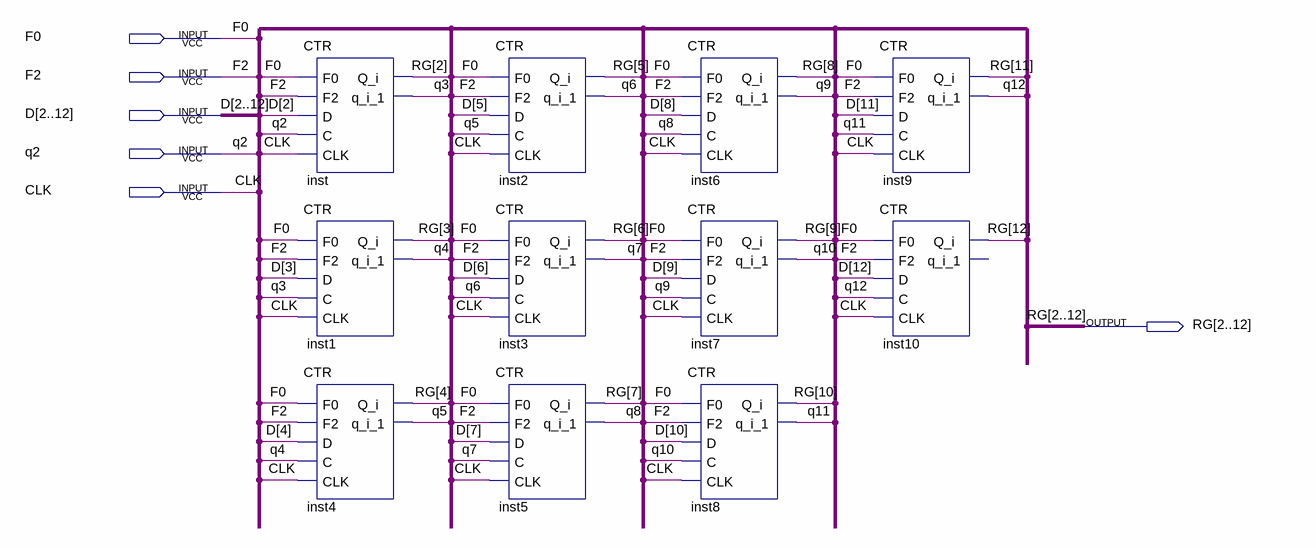
[diagram p0: schematic sheet]
// Quartus schematic CTR11.bdf as structural Verilog: 11 symbols, 6 pins
module CTR11 (
  input  F0,
  input  F2,
  input  [2:12] D,
  input  q2,
  input  CLK,
  output [2:12] RG
);

  wire q3, q4, q5, q6, q7, q8, q9, q10, q11, q12;

  CTR inst (.F0(F0), .F2(F2), .D(D[2]), .C(q2), .CLK(CLK), .q_i_1(q3), .Q_i(RG[2]));
  CTR inst1 (.F0(F0), .F2(F2), .D(D[3]), .C(q3), .CLK(CLK), .q_i_1(q4), .Q_i(RG[3]));
  CTR inst4 (.F0(F0), .F2(F2), .D(D[4]), .C(q4), .CLK(CLK), .q_i_1(q5), .Q_i(RG[4]));
  CTR inst2 (.F0(F0), .F2(F2), .D(D[5]), .C(q5), .CLK(CLK), .q_i_1(q6), .Q_i(RG[5]));
  CTR inst3 (.F0(F0), .F2(F2), .D(D[6]), .C(q6), .CLK(CLK), .q_i_1(q7), .Q_i(RG[6]));
  CTR inst5 (.F0(F0), .F2(F2), .D(D[7]), .C(q7), .CLK(CLK), .q_i_1(q8), .Q_i(RG[7]));
  CTR inst6 (.F0(F0), .F2(F2), .D(D[8]), .C(q8), .CLK(CLK), .q_i_1(q9), .Q_i(RG[8]));
  CTR inst7 (.F0(F0), .F2(F2), .D(D[9]), .C(q9), .CLK(CLK), .q_i_1(q10), .Q_i(RG[9]));
  CTR inst8 (.F0(F0), .F2(F2), .D(D[10]), .C(q10), .CLK(CLK), .q_i_1(q11), .Q_i(RG[10]));
  CTR inst9 (.F0(F0), .F2(F2), .D(D[11]), .C(q11), .CLK(CLK), .q_i_1(q12), .Q_i(RG[11]));
  CTR inst10 (.F0(F0), .F2(F2), .D(D[12]), .C(q12), .CLK(CLK), .Q_i(RG[12]));  // open: q_i_1
endmodule
